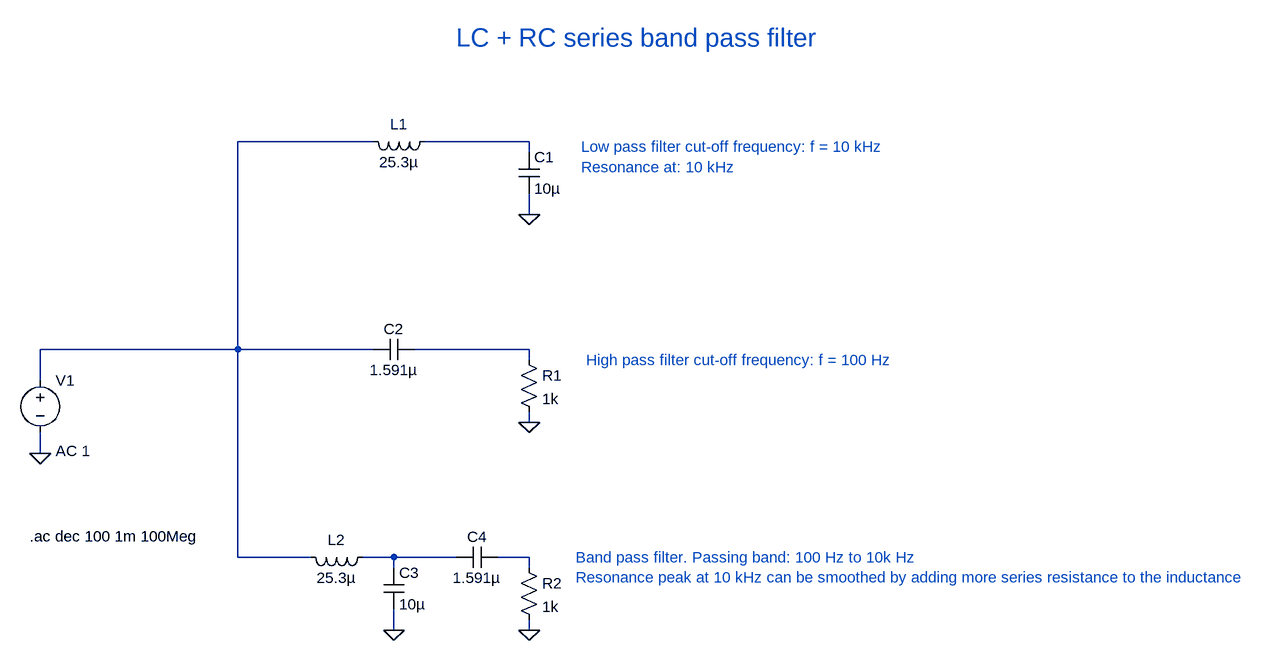
[diagram p0: schematic LC-and-RC-series- bandpass-filter.asc]
LC-and-RC-series- bandpass-filter.asc, the LTspice schematic file:
Version 4
SHEET 1 1640 692
WIRE 240 -80 32 -80
WIRE 480 -80 320 -80
WIRE 480 -64 480 -80
WIRE 480 32 480 0
WIRE 32 240 32 -80
WIRE 32 240 -272 240
WIRE 240 240 32 240
WIRE 480 240 304 240
WIRE 480 256 480 240
WIRE -272 288 -272 240
WIRE 480 352 480 336
WIRE -272 400 -272 368
WIRE 32 560 32 240
WIRE 144 560 32 560
WIRE 272 560 224 560
WIRE 368 560 272 560
WIRE 480 560 432 560
WIRE 272 576 272 560
WIRE 480 576 480 560
WIRE 272 672 272 640
WIRE 480 672 480 656
FLAG 480 32 0
FLAG 480 352 0
FLAG -272 400 0
FLAG 272 672 0
FLAG 480 672 0
SYMBOL ind 336 -96 R90
WINDOW 0 5 56 VBottom 2
WINDOW 3 32 56 VTop 2
SYMATTR InstName L1
SYMATTR Value 25.3µ
SYMBOL cap 464 -64 R0
SYMATTR InstName C1
SYMATTR Value 10µ
SYMBOL cap 304 224 R90
WINDOW 0 0 32 VBottom 2
WINDOW 3 32 32 VTop 2
SYMATTR InstName C2
SYMATTR Value 1.591µ
SYMBOL res 464 240 R0
SYMATTR InstName R1
SYMATTR Value 1k
SYMBOL voltage -272 272 R0
WINDOW 123 24 124 Left 2
WINDOW 39 0 0 Left 0
SYMATTR Value2 AC 1
SYMATTR InstName V1
SYMATTR Value ""
SYMBOL ind 240 544 R90
WINDOW 0 5 56 VBottom 2
WINDOW 3 32 56 VTop 2
SYMATTR InstName L2
SYMATTR Value 25.3µ
SYMATTR SpiceLine Rser=100m
SYMBOL cap 256 576 R0
SYMATTR InstName C3
SYMATTR Value 10µ
SYMBOL cap 432 544 R90
WINDOW 0 0 32 VBottom 2
WINDOW 3 32 32 VTop 2
SYMATTR InstName C4
SYMATTR Value 1.591µ
SYMBOL res 464 560 R0
SYMATTR InstName R2
SYMATTR Value 1k
TEXT -288 528 Left 2 !.ac dec 100 1m 100Meg
TEXT 560 -72 Left 2 ;Low pass filter cut-off frequency: f = 10 kHz\nResonance at: 10 kHz
TEXT 568 256 Left 2 ;High pass filter cut-off frequency: f = 100 Hz
TEXT 552 560 Left 2 ;Band pass filter. Passing band: 100 Hz to 10k Hz\nResonance peak at 10 kHz can be smoothed by adding more series resistance to the inductance
TEXT 368 -240 Left 4 ;LC + RC series band pass filter

The netlist it stands for:
* LC-and-RC-series- bandpass-filter.asc
L1 N002 N001 25.3µ
C1 N002 0 10µ
C2 N003 N001 1.591µ
R1 N003 0 1k
V1 N001 0 AC 1
L2 N004 N001 25.3µ Rser=100m
C3 N004 0 10µ
C4 N005 N004 1.591µ
R2 N005 0 1k
.ac dec 100 1m 100Meg
* Low pass filter cut-off frequency: f = 10 kHz
* Resonance at: 10 kHz
* High pass filter cut-off frequency: f = 100 Hz
* Band pass filter. Passing band: 100 Hz to 10k Hz
* Resonance peak at 10 kHz can be smoothed by adding more series resistance to the inductance
* LC + RC series band pass filter
.backanno
.end